# Altium schematic sheet [5]-MIPI-CSI_GPIOs and I2C.SchDoc: RK3399 SOM Board Design V1.0
size A4; Author: AVIRAL MISHRA; DocumentNumber: 6; SheetNumber: 6; SheetTotal: 12; PROJECT CODE: A_V1.0
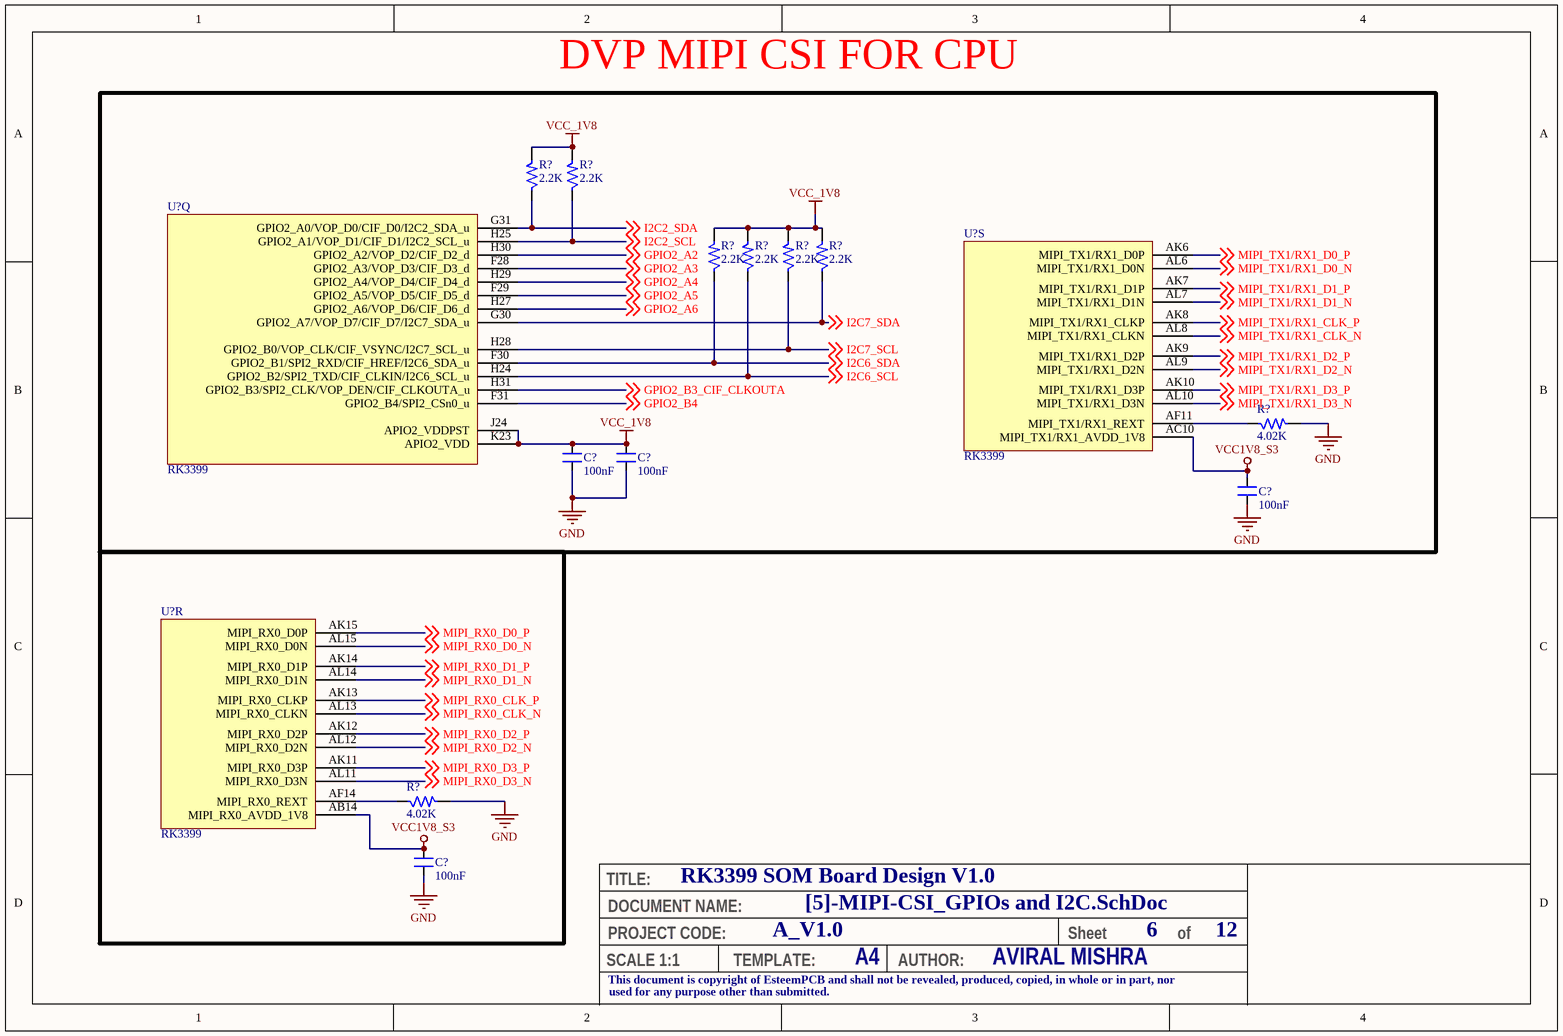
[diagram p0: [5]-MIPI-CSI_GPIOs and I2C.SchDoc]

## Parts
(Parts that share a designator on the sheet are numbered #1, #2 ... from top to bottom, then left to right.)
C?#1  100nF  [CAP_0201]
C?#2  100nF  [CAP_0201]
C?#3  100nF  [CAP_0201]
C?#4  100nF  [CAP_0201]
R?#1  2.2K  [RES_0201]
R?#2  2.2K  [RES_0201]
R?#3  2.2K  [RES_0201]
R?#4  2.2K  [RES_0201]
R?#5  2.2K  [RES_0201]
R?#6  2.2K  [RES_0201]
R?#7  4.02K  [RES_0201]
R?#8  4.02K  [RES_0201]
U?#1  RK3399  [FBGA828_23_826X826]  (part Q of 24)
U?#2  RK3399  [FBGA828_23_826X826]  (part S of 24)
U?#3  RK3399  [FBGA828_23_826X826]  (part R of 24)

## Blocks framed on the sheet
DVP MIPI CSI FOR CPU: C?#1-C?#3 R?#1-R?#7 U?#1 U?#2

## Nets
GND: C?#1.1 C?#2.1 C?#3.1 C?#4.1 R?#7.2 R?#8.2
VCC1V8_S3: C?#3.2 C?#4.2 U?#2.AC10(MIPI_TX1/RX1_AVDD_1V8) U?#3.AB14(MIPI_RX0_AVDD_1V8)
VCC_1V8: C?#1.2 C?#2.2 R?#1.2 R?#2.2 R?#3.2 R?#4.2 R?#5.2 R?#6.2 U?#1.J24(APIO2_VDDPST) U?#1.K23(APIO2_VDD)
GPIO2_A2: U?#1.H30(GPIO2_A2/VOP_D2/CIF_D2_d) ; off-sheet GPIO2_A2
GPIO2_A3: U?#1.F28(GPIO2_A3/VOP_D3/CIF_D3_d) ; off-sheet GPIO2_A3
GPIO2_A4: U?#1.H29(GPIO2_A4/VOP_D4/CIF_D4_d) ; off-sheet GPIO2_A4
GPIO2_A5: U?#1.F29(GPIO2_A5/VOP_D5/CIF_D5_d) ; off-sheet GPIO2_A5
GPIO2_A6: U?#1.H27(GPIO2_A6/VOP_D6/CIF_D6_d) ; off-sheet GPIO2_A6
GPIO2_B3_CIF_CLKOUTA: U?#1.H31(GPIO2_B3/SPI2_CLK/VOP_DEN/CIF_CLKOUTA_u) ; off-sheet GPIO2_B3_CIF_CLKOUTA
GPIO2_B4: U?#1.F31(GPIO2_B4/SPI2_CSn0_u) ; off-sheet GPIO2_B4
I2C2_SCL: R?#2.1 U?#1.H25(GPIO2_A1/VOP_D1/CIF_D1/I2C2_SCL_u) ; off-sheet I2C2_SCL
I2C2_SDA: R?#1.1 U?#1.G31(GPIO2_A0/VOP_D0/CIF_D0/I2C2_SDA_u) ; off-sheet I2C2_SDA
I2C6_SCL: R?#4.1 U?#1.H24(GPIO2_B2/SPI2_TXD/CIF_CLKIN/I2C6_SCL_u) ; off-sheet I2C6_SCL
I2C6_SDA: R?#3.1 U?#1.F30(GPIO2_B1/SPI2_RXD/CIF_HREF/I2C6_SDA_u) ; off-sheet I2C6_SDA
I2C7_SCL: R?#5.1 U?#1.H28(GPIO2_B0/VOP_CLK/CIF_VSYNC/I2C7_SCL_u) ; off-sheet I2C7_SCL
I2C7_SDA: R?#6.1 U?#1.G30(GPIO2_A7/VOP_D7/CIF_D7/I2C7_SDA_u) ; off-sheet I2C7_SDA
MIPI_RX0_CLK_N: U?#3.AL13(MIPI_RX0_CLKN) ; off-sheet MIPI_RX0_CLK_N
MIPI_RX0_CLK_P: U?#3.AK13(MIPI_RX0_CLKP) ; off-sheet MIPI_RX0_CLK_P
MIPI_RX0_D0_N: U?#3.AL15(MIPI_RX0_D0N) ; off-sheet MIPI_RX0_D0_N
MIPI_RX0_D0_P: U?#3.AK15(MIPI_RX0_D0P) ; off-sheet MIPI_RX0_D0_P
MIPI_RX0_D1_N: U?#3.AL14(MIPI_RX0_D1N) ; off-sheet MIPI_RX0_D1_N
MIPI_RX0_D1_P: U?#3.AK14(MIPI_RX0_D1P) ; off-sheet MIPI_RX0_D1_P
MIPI_RX0_D2_N: U?#3.AL12(MIPI_RX0_D2N) ; off-sheet MIPI_RX0_D2_N
MIPI_RX0_D2_P: U?#3.AK12(MIPI_RX0_D2P) ; off-sheet MIPI_RX0_D2_P
MIPI_RX0_D3_N: U?#3.AL11(MIPI_RX0_D3N) ; off-sheet MIPI_RX0_D3_N
MIPI_RX0_D3_P: U?#3.AK11(MIPI_RX0_D3P) ; off-sheet MIPI_RX0_D3_P
MIPI_TX1/RX1_CLK_N: U?#2.AL8(MIPI_TX1/RX1_CLKN) ; off-sheet MIPI_TX1/RX1_CLK_N
MIPI_TX1/RX1_CLK_P: U?#2.AK8(MIPI_TX1/RX1_CLKP) ; off-sheet MIPI_TX1/RX1_CLK_P
MIPI_TX1/RX1_D0_N: U?#2.AL6(MIPI_TX1/RX1_D0N) ; off-sheet MIPI_TX1/RX1_D0_N
MIPI_TX1/RX1_D0_P: U?#2.AK6(MIPI_TX1/RX1_D0P) ; off-sheet MIPI_TX1/RX1_D0_P
MIPI_TX1/RX1_D1_N: U?#2.AL7(MIPI_TX1/RX1_D1N) ; off-sheet MIPI_TX1/RX1_D1_N
MIPI_TX1/RX1_D1_P: U?#2.AK7(MIPI_TX1/RX1_D1P) ; off-sheet MIPI_TX1/RX1_D1_P
MIPI_TX1/RX1_D2_N: U?#2.AL9(MIPI_TX1/RX1_D2N) ; off-sheet MIPI_TX1/RX1_D2_N
MIPI_TX1/RX1_D2_P: U?#2.AK9(MIPI_TX1/RX1_D2P) ; off-sheet MIPI_TX1/RX1_D2_P
MIPI_TX1/RX1_D3_N: U?#2.AL10(MIPI_TX1/RX1_D3N) ; off-sheet MIPI_TX1/RX1_D3_N
MIPI_TX1/RX1_D3_P: U?#2.AK10(MIPI_TX1/RX1_D3P) ; off-sheet MIPI_TX1/RX1_D3_P
NetR?#7_1: R?#7.1 U?#2.AF11(MIPI_TX1/RX1_REXT)
NetR?#8_1: R?#8.1 U?#3.AF14(MIPI_RX0_REXT)

## Notes on the sheet
- TITLE:
- DOCUMENT NAME:
- SCALE 1:1
- This document is copyright of EsteemPCB and shall not be revealed, produced, copied, in whole or in part, nor
- PROJECT CODE:
- TEMPLATE:
- A4
- AUTHOR:
- Sheet
- of
- used for any purpose other than submitted.

## Library data of the parts
C?#1-C?#4 = CAP_100nF-25V-10%-0201: 0.1µF ±10% 25V Ceramic Capacitor X5R 0201 (0603 Metric) /; Manufacturer: TDK Corporation; Manufacturer Part Number: C0603X5R1E104K030BB; Case/Package: 0201; Supplier-1: Digikey
R?#1-R?#6 = RES_2.2K-0.05W-1%-0201: 2.2 kOhms ±1% 0.05W, 1/20W Chip Resistor 0201 (0603 Metric) Thick Film /; Manufacturer: Stackpole Electronics Inc; Manufacturer Part Number: RMCF0201FT2K20; Case/Package: 0201; Supplier-1: Digikey
R?#7 R?#8 = RES_4.02K-0.05W-1%-0201: 4.02 kOhms ±1% 0.05W, 1/20W Chip Resistor 0201 (0603 Metric) Thick Film /; Manufacturer: Yageo; Manufacturer Part Number: RC0201FR-074K02L; Case/Package: 0201; Supplier-1: Digikey
U?#1-U?#3 = IC_RK3399-FCBGA828: RK3399 is a low power, high performance processor for computing, personal mobile.; Manufacturer: Rockchip; Manufacturer Part Number: RK3399; Case/Package: FCBGA828; Supplier-1: Rockchip